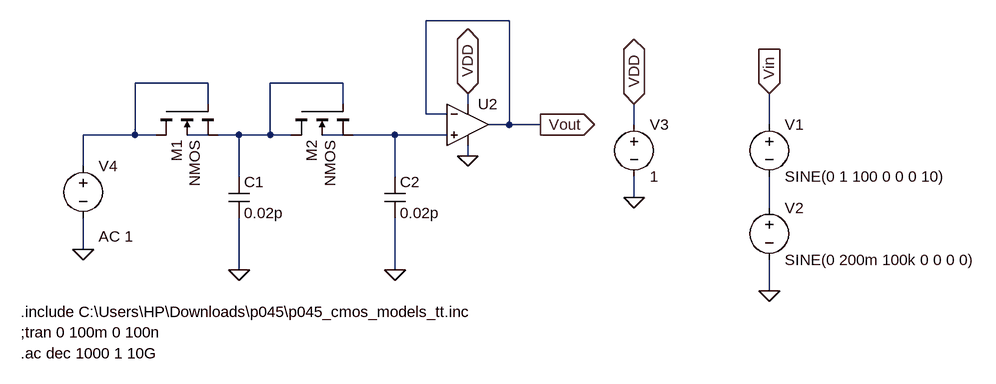
[diagram p0: schematic lpf.asc]
lpf.asc, the LTspice schematic file:
Version 4
SHEET 1 1080 680
WIRE 336 -64 208 -64
WIRE -128 32 -240 32
WIRE 80 32 -32 32
WIRE -128 64 -128 32
WIRE 80 64 80 32
WIRE 272 64 272 48
WIRE 208 80 208 -64
WIRE 240 80 208 80
WIRE 336 96 336 -64
WIRE 336 96 304 96
WIRE 384 96 336 96
WIRE 528 96 528 64
WIRE 736 96 736 48
WIRE -240 112 -240 32
WIRE -240 112 -320 112
WIRE -208 112 -240 112
WIRE -128 112 -160 112
WIRE -80 112 -112 112
WIRE -32 112 -32 32
WIRE -32 112 -80 112
WIRE 0 112 -32 112
WIRE 80 112 48 112
WIRE 160 112 96 112
WIRE 240 112 160 112
WIRE 272 144 272 128
WIRE -320 160 -320 112
WIRE -80 176 -80 112
WIRE 160 176 160 112
WIRE 528 208 528 176
WIRE 736 224 736 176
WIRE -320 288 -320 240
WIRE -80 320 -80 240
WIRE 160 320 160 240
WIRE 736 352 736 304
FLAG -80 320 0
FLAG 160 320 0
FLAG 384 96 Vout
IOPIN 384 96 Out
FLAG 736 48 Vin
IOPIN 736 48 In
FLAG 736 352 0
FLAG 272 144 0
FLAG 272 48 VDD
IOPIN 272 48 BiDir
FLAG 528 208 0
FLAG 528 64 VDD
IOPIN 528 64 BiDir
FLAG -320 288 0
SYMBOL cap -96 176 R0
SYMATTR InstName C1
SYMATTR Value 0.02p
SYMBOL cap 144 176 R0
SYMATTR InstName C2
SYMATTR Value 0.02p
SYMBOL voltage 736 80 R0
WINDOW 123 0 0 Left 0
WINDOW 39 0 0 Left 0
SYMATTR InstName V1
SYMATTR Value SINE(0 1 100 0 0 0 10)
SYMBOL voltage 736 208 R0
WINDOW 123 0 0 Left 0
WINDOW 39 0 0 Left 0
SYMATTR InstName V2
SYMATTR Value SINE(0 200m 100k 0 0 0 0)
SYMBOL nmos4 -208 64 M90
WINDOW 3 56 60 Left 2
SYMATTR InstName M1
SYMATTR Value2 l=0.05u w=5u
SYMBOL nmos4 0 64 M90
WINDOW 3 56 60 Left 2
SYMATTR InstName M2
SYMATTR Value2 l=0.05u w=5u
SYMBOL voltage 528 80 R0
WINDOW 123 0 0 Left 0
WINDOW 39 0 0 Left 0
SYMATTR InstName V3
SYMATTR Value 1
SYMBOL OpAmps\\UniversalOpAmp 272 96 R0
SYMATTR InstName U2
SYMBOL voltage -320 144 R0
WINDOW 123 24 124 Left 2
WINDOW 39 0 0 Left 0
SYMATTR Value2 AC 1
SYMATTR InstName V4
SYMATTR Value ""
TEXT -416 416 Left 2 !;tran 0 100m 0 100n
TEXT -416 384 Left 2 !.include C:\\Users\\HP\\Downloads\\p045\\p045_cmos_models_tt.inc
TEXT -416 448 Left 2 !.ac dec 1000 1 10G

The netlist it stands for:
* lpf.asc
C1 N002 0 0.02p
C2 N005 0 0.02p
V1 Vin N006 SINE(0 1 100 0 0 0 10)
V2 N006 0 SINE(0 200m 100k 0 0 0 0)
M1 N001 N001 N002 N003 NMOS l=0.05u w=5u
M2 N002 N002 N005 N004 NMOS l=0.05u w=5u
V3 VDD 0 1
XU2 N005 Vout VDD 0 Vout level1 Avol=1Meg GBW=10Meg Vos=0 En=0 Enk=0 In=0 Ink=0 Rin=500Meg  ; pins In+ In- V+ V- OUT
V4 N001 0 AC 1
.model NMOS NMOS
.model PMOS PMOS
.lib standard.mos
;tran 0 100m 0 100n
.include C:\Users\HP\Downloads\p045\p045_cmos_models_tt.inc
.ac dec 1000 1 10G
.lib UniversalOpAmp1.lib
.backanno
.end